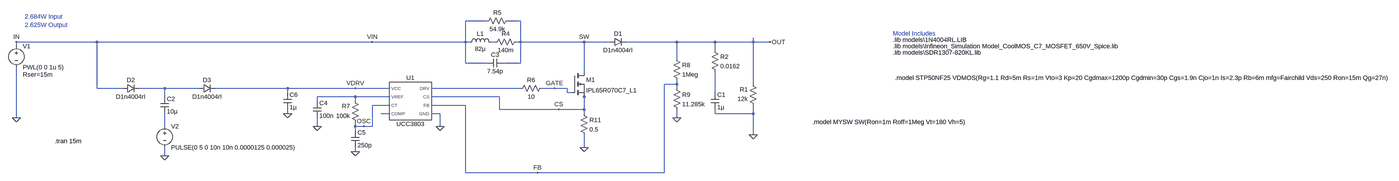
[diagram p0: schematic NewBoostUCC3803.asc, whole sheet]
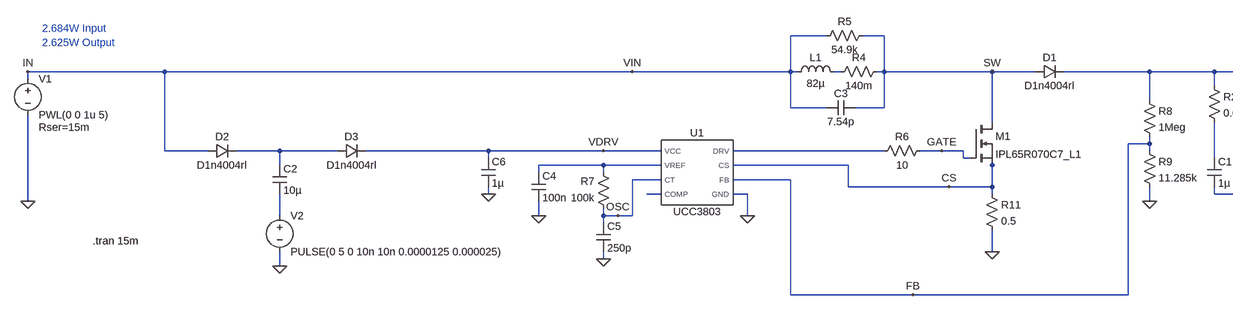
[diagram p1: schematic NewBoostUCC3803.asc, part, row 1 of 1, column 1 of 2]
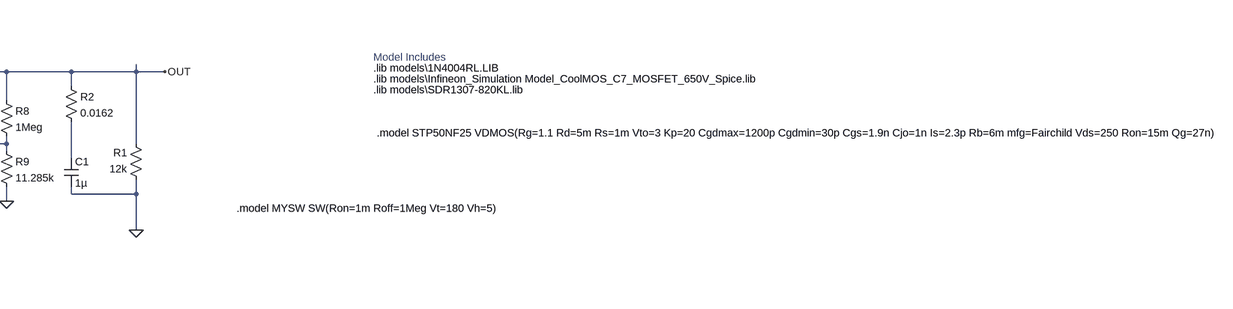
[diagram p2: schematic NewBoostUCC3803.asc, part, row 1 of 1, column 2 of 2]
NewBoostUCC3803.asc, the LTspice schematic file:
Version 4
SHEET 1 3996 712
WIRE 416 0 336 0
WIRE 544 0 496 0
WIRE -1056 80 -1360 80
WIRE -16 80 -1056 80
WIRE 336 80 336 0
WIRE 336 80 -16 80
WIRE 352 80 336 80
WIRE 448 80 432 80
WIRE 544 80 544 0
WIRE 544 80 528 80
WIRE 784 80 544 80
WIRE 880 80 784 80
WIRE 1136 80 944 80
WIRE 1280 80 1136 80
WIRE 1424 80 1424 64
WIRE 1424 80 1280 80
WIRE 1488 80 1424 80
WIRE -1360 96 -1360 80
WIRE 1280 112 1280 80
WIRE 1136 144 1136 80
WIRE 336 160 336 80
WIRE 416 160 336 160
WIRE 544 160 544 80
WIRE 544 160 480 160
WIRE 784 192 784 80
WIRE 1136 240 1136 224
WIRE 1136 240 1088 240
WIRE 1424 240 1424 80
WIRE -1056 256 -1056 80
WIRE -960 256 -1056 256
WIRE -800 256 -896 256
WIRE -672 256 -800 256
WIRE -336 256 -608 256
WIRE -80 256 -336 256
WIRE 48 256 -80 256
WIRE 544 256 208 256
WIRE 672 256 624 256
WIRE 720 256 672 256
WIRE 1136 256 1136 240
WIRE -336 272 -336 256
WIRE 720 272 720 256
WIRE 736 272 720 272
WIRE 1280 272 1280 192
WIRE -800 288 -800 256
WIRE -80 288 -224 288
WIRE 48 288 -80 288
WIRE 464 288 208 288
WIRE 784 288 784 272
WIRE -224 304 -224 288
WIRE -80 304 -80 288
WIRE 48 320 -16 320
WIRE 336 320 208 320
WIRE 464 336 464 288
WIRE 688 336 464 336
WIRE 784 336 784 288
WIRE 784 336 688 336
WIRE -336 352 -336 336
WIRE 48 352 16 352
WIRE 240 352 208 352
WIRE 784 352 784 336
WIRE 1280 352 1280 336
WIRE 1424 352 1424 320
WIRE 1424 352 1280 352
WIRE -1360 368 -1360 176
WIRE 1136 368 1136 336
WIRE -800 400 -800 352
WIRE -224 400 -224 368
WIRE -80 400 -80 384
WIRE -48 400 -80 400
WIRE -16 400 -16 320
WIRE -16 400 -48 400
WIRE 240 400 240 352
WIRE -80 416 -80 400
WIRE 1424 432 1424 352
WIRE 784 480 784 432
WIRE -80 496 -80 480
WIRE -800 512 -800 480
WIRE 336 576 336 320
WIRE 608 576 336 576
WIRE 1088 576 1088 240
WIRE 1088 576 608 576
FLAG -1360 368 0
FLAG 1424 432 0
FLAG 784 480 0
FLAG -1360 80 IN
FLAG 1488 80 OUT
FLAG 240 400 0
FLAG -224 400 0
FLAG -80 496 0
FLAG 1136 368 0
FLAG -336 352 0
FLAG -800 512 0
FLAG 688 336 CS
FLAG 608 576 FB
FLAG -16 80 VIN
FLAG -80 256 VDRV
FLAG -48 400 OSC
FLAG 672 256 GATE
FLAG 784 80 SW
SYMBOL voltage -1360 80 R0
WINDOW 123 0 0 Left 0
WINDOW 39 24 124 Left 2
SYMATTR SpiceLine Rser=15m
SYMATTR InstName V1
SYMATTR Value PWL(0 0 1u 5)
SYMBOL res 1440 336 R180
WINDOW 0 36 76 Left 2
WINDOW 3 36 40 Left 2
SYMATTR InstName R1
SYMATTR Value 12k
SYMBOL cap 1264 272 R0
SYMATTR InstName C1
SYMATTR Value 1µ
SYMBOL diode 880 96 R270
WINDOW 0 32 32 VTop 2
WINDOW 3 0 32 VBottom 2
SYMATTR InstName D1
SYMATTR Value D1n4004rl
SYMBOL res 1264 96 R0
SYMATTR InstName R2
SYMATTR Value 0.0162
SYMBOL ind 336 96 R270
WINDOW 0 32 56 VTop 2
WINDOW 3 5 56 VBottom 2
SYMATTR InstName L1
SYMATTR Value 82µ
SYMBOL res 544 64 R90
WINDOW 0 0 56 VBottom 2
WINDOW 3 32 56 VTop 2
SYMATTR InstName R4
SYMATTR Value 140m
SYMBOL cap 480 144 R90
WINDOW 0 0 32 VBottom 2
WINDOW 3 32 32 VTop 2
SYMATTR InstName C3
SYMATTR Value 7.54p
SYMBOL res 512 -16 R90
WINDOW 0 0 56 VBottom 2
WINDOW 3 32 56 VTop 2
SYMATTR InstName R5
SYMATTR Value 54.9k
SYMBOL res 640 240 R90
WINDOW 0 0 56 VBottom 2
WINDOW 3 32 56 VTop 2
SYMATTR InstName R6
SYMATTR Value 10
SYMBOL cap -240 304 R0
SYMATTR InstName C4
SYMATTR Value 100n
SYMBOL res -64 400 R180
WINDOW 0 36 76 Left 2
WINDOW 3 36 40 Left 2
SYMATTR InstName R7
SYMATTR Value 100k
SYMBOL cap -96 416 R0
SYMATTR InstName C5
SYMATTR Value 250p
SYMBOL res 1120 128 R0
SYMATTR InstName R8
SYMATTR Value 1Meg
SYMBOL res 1120 240 R0
SYMATTR InstName R9
SYMATTR Value 11.285k
SYMBOL res 768 336 R0
SYMATTR InstName R11
SYMATTR Value 0.5
SYMBOL UCC3803 128 304 R0
SYMATTR InstName U1
SYMBOL diode -960 272 R270
WINDOW 0 32 32 VTop 2
WINDOW 3 0 32 VBottom 2
SYMATTR InstName D2
SYMATTR Value D1n4004rl
SYMBOL diode -672 272 R270
WINDOW 0 32 32 VTop 2
WINDOW 3 0 32 VBottom 2
SYMATTR InstName D3
SYMATTR Value D1n4004rl
SYMBOL cap -816 288 R0
SYMATTR InstName C2
SYMATTR Value 10µ
SYMBOL cap -352 272 R0
SYMATTR InstName C6
SYMATTR Value 1µ
SYMBOL nmos 736 192 R0
SYMATTR InstName M1
SYMATTR Value IPL65R070C7_L1
SYMATTR Prefix X
SYMBOL voltage -800 384 R0
WINDOW 123 0 0 Left 0
WINDOW 39 0 0 Left 0
SYMATTR InstName V2
SYMATTR Value PULSE(0 5 0 10n 10n 0.0000125 0.000025)
TEXT 1968 96 Left 2 !.lib models\\Infineon_Simulation Model_CoolMOS_C7_MOSFET_650V_Spice.lib
TEXT -1216 456 Left 2 !.tran 15m
TEXT -1328 -16 Left 2 ;2.684W Input\n2.625W Output
TEXT 1968 72 Left 2 !.lib models\\1N4004RL.LIB
TEXT 1968 48 Left 2 ;Model Includes
TEXT 1968 120 Left 2 !.lib models\\SDR1307-820KL.lib
TEXT 1976 216 Left 2 !.model STP50NF25 VDMOS(Rg=1.1 Rd=5m Rs=1m Vto=3 Kp=20 Cgdmax=1200p Cgdmin=30p Cgs=1.9n Cjo=1n Is=2.3p Rb=6m mfg=Fairchild Vds=250 Ron=15m Qg=27n)
TEXT 1664 384 Left 2 !.model MYSW SW(Ron=1m Roff=1Meg Vt=180 Vh=5)

The netlist it stands for:
* NewBoostUCC3803.asc
V1 VIN 0 PWL(0 0 1u 5) Rser=15m
R1 0 OUT 12k
C1 N004 0 1µ
D1 SW OUT D1n4004rl
R2 OUT N004 0.0162
L1 VIN N001 82µ
R4 SW N001 140m
C3 SW VIN 7.54p
R5 SW VIN 54.9k
R6 GATE N003 10
C4 N005 0 100n
R7 OSC N005 100k
C5 OSC 0 250p
R8 OUT FB 1Meg
R9 FB 0 11.285k
R11 CS 0 0.5
XU1 N006 FB CS OSC 0 N003 VDRV N005 UCC3803  ; pins COMP FB CS CT GND DRV VCC VREF
D2 VIN N002 D1n4004rl
D3 N002 VDRV D1n4004rl
C2 N002 N007 10µ
C6 VDRV 0 1µ
XM1 SW GATE CS IPL65R070C7_L1  ; pins D G S
V2 N007 0 PULSE(0 5 0 10n 10n 0.0000125 0.000025)
.model D D
.lib standard.dio
.lib models\Infineon_Simulation Model_CoolMOS_C7_MOSFET_650V_Spice.lib
.tran 15m
* 2.684W Input
* 2.625W Output
.lib models\1N4004RL.LIB
* Model Includes
.lib models\SDR1307-820KL.lib
.model STP50NF25 VDMOS(Rg=1.1 Rd=5m Rs=1m Vto=3 Kp=20 Cgdmax=1200p Cgdmin=30p Cgs=1.9n Cjo=1n Is=2.3p Rb=6m mfg=Fairchild Vds=250 Ron=15m Qg=27n)
.model MYSW SW(Ron=1m Roff=1Meg Vt=180 Vh=5)
.lib models\UCCx803\uccx813-3.lib
.backanno
.end